# Altium schematic sheet EsquemaGeral.SchDoc
size A3
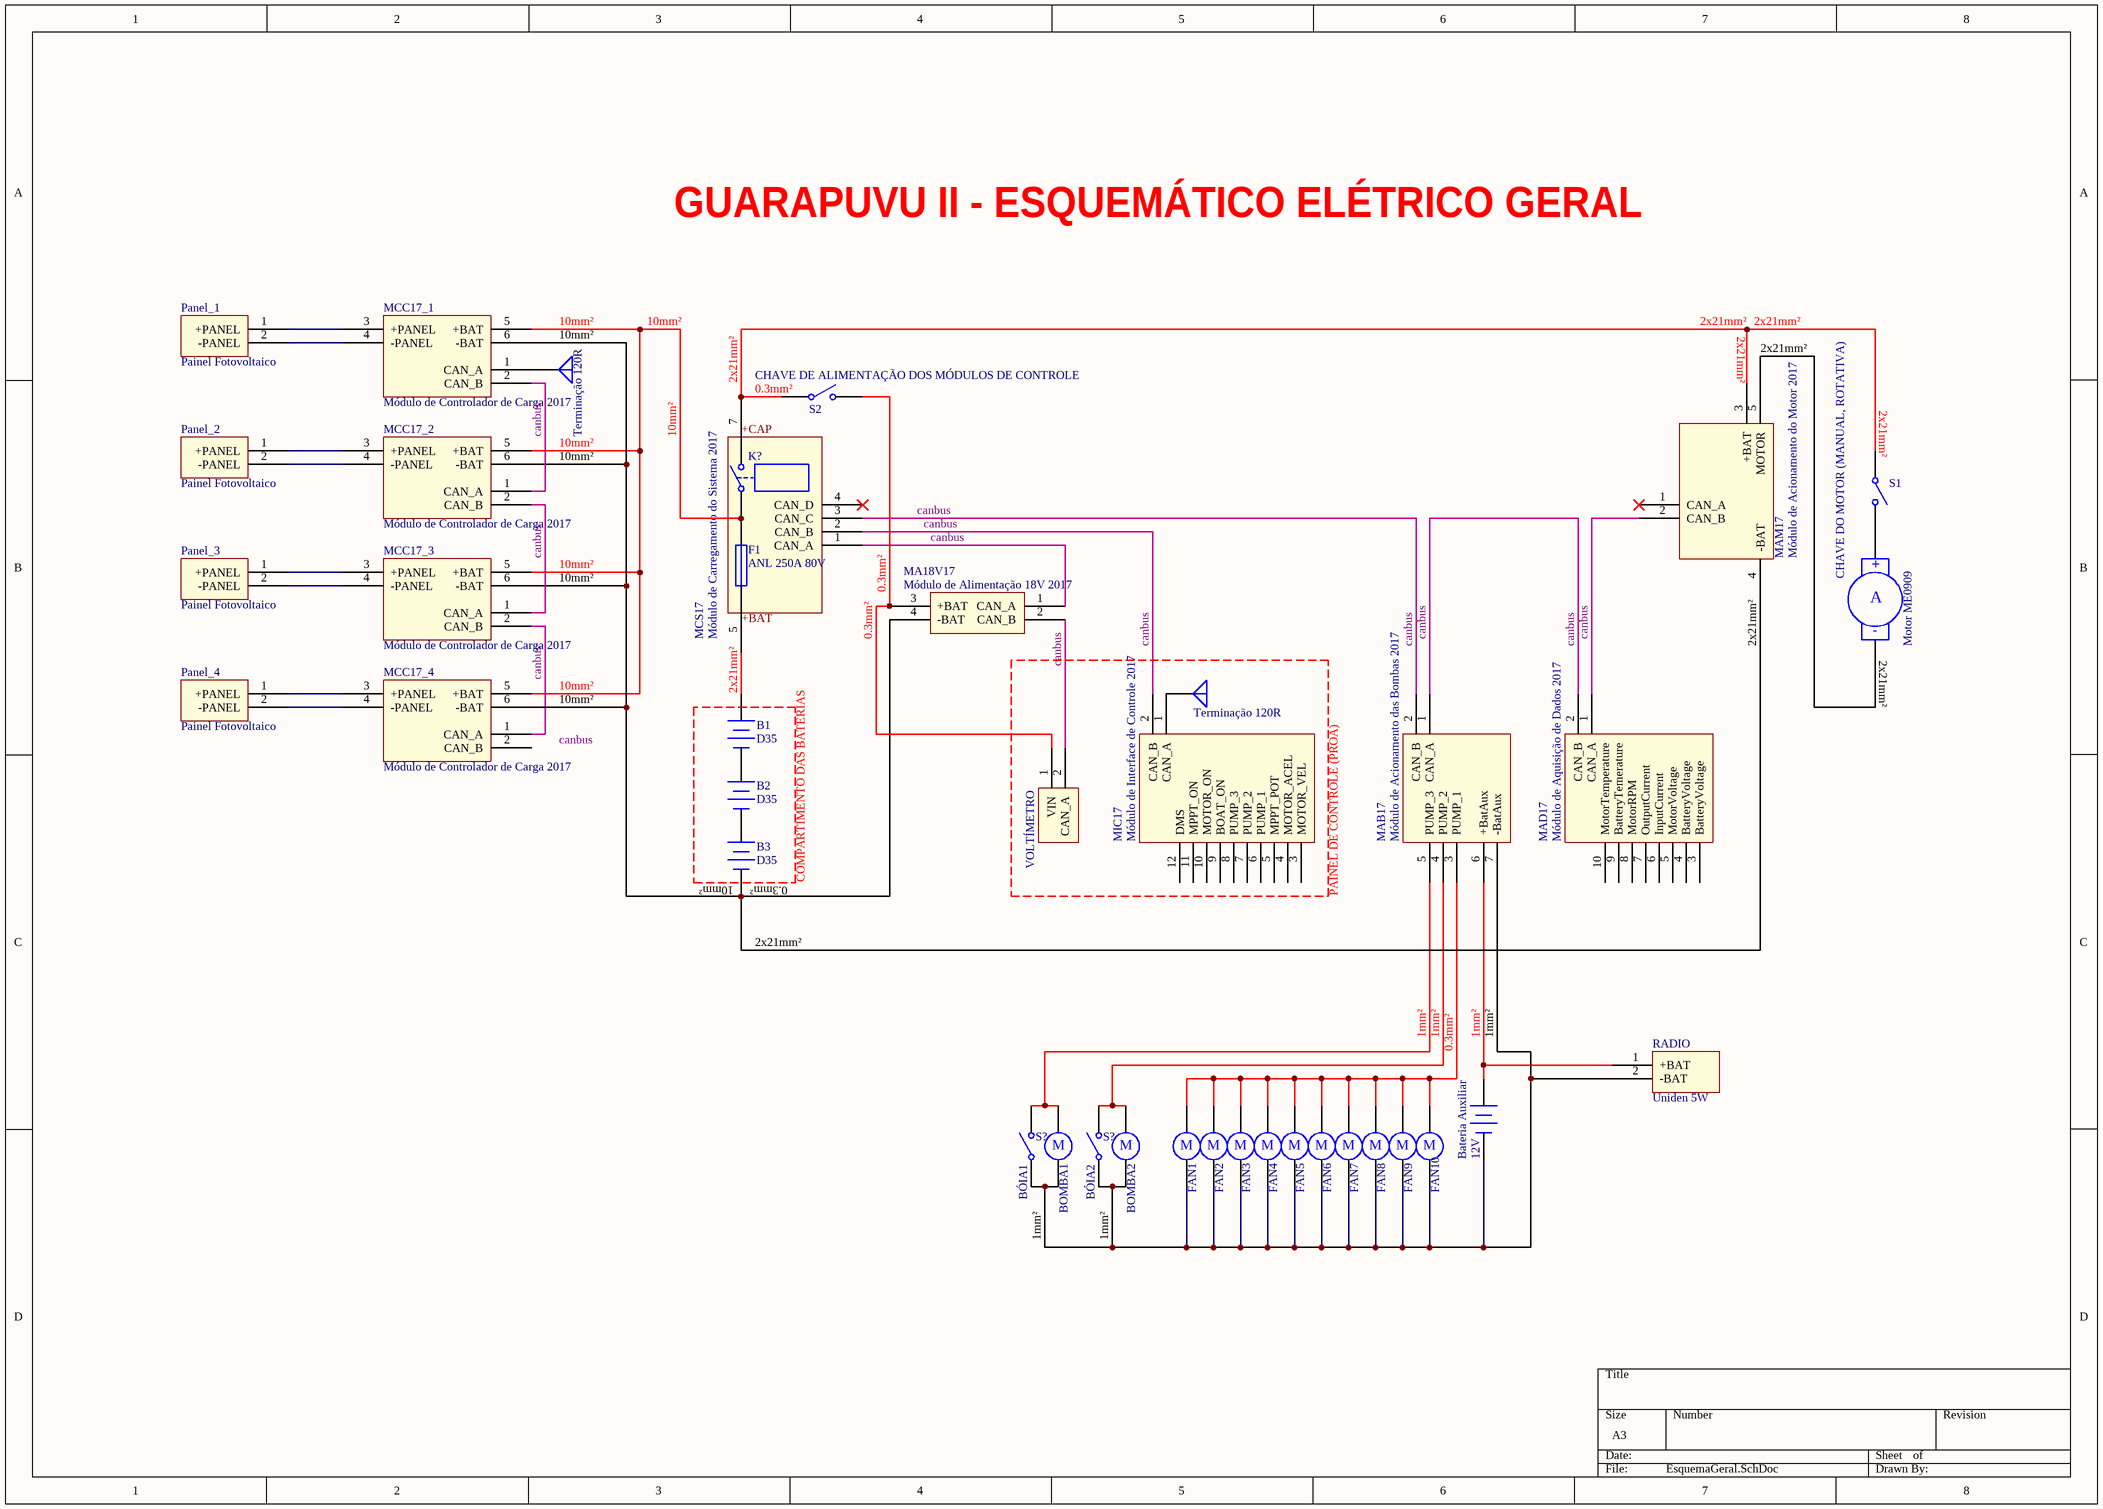
[diagram p0: EsquemaGeral.SchDoc]

## Parts
(Parts that share a designator on the sheet are numbered #1, #2 ... from top to bottom, then left to right.)
B1  D35  [BAT-2]
B2  D35  [BAT-2]
B3  D35  [BAT-2]
Bateria_Auxiliar  12V  [BAT-2]
BOMBA1  Motor  [RB5-10.5]  (value not drawn)
BOMBA2  Motor  [RB5-10.5]  (value not drawn)
F1  ANL 250A 80V  [PIN-W2/E2.8]
FAN1  Motor  [RB5-10.5]  (value not drawn)
FAN2  Motor  [RB5-10.5]  (value not drawn)
FAN3  Motor  [RB5-10.5]  (value not drawn)
FAN4  Motor  [RB5-10.5]  (value not drawn)
FAN5  Motor  [RB5-10.5]  (value not drawn)
FAN6  Motor  [RB5-10.5]  (value not drawn)
FAN7  Motor  [RB5-10.5]  (value not drawn)
FAN8  Motor  [RB5-10.5]  (value not drawn)
FAN9  Motor  [RB5-10.5]  (value not drawn)
FAN10  Motor  [RB5-10.5]  (value not drawn)
K?  K100A  [DIP-P4]  (value not drawn)
M1  Motor ME0909  [RAD-0.4]
MA18V17  Módulo de Alimentação 18V 2017
MAB17  Módulo de Acionamento das Bombas 2017
MAD17  Módulo de Aquisição de Dados 2017
MAM17  Módulo de Acionamento do Motor 2017
MCC17_1  Módulo de Controlador de Carga 2017
MCC17_2  Módulo de Controlador de Carga 2017
MCC17_3  Módulo de Controlador de Carga 2017
MCC17_4  Módulo de Controlador de Carga 2017
MCS17  Módulo de Carregamento do Sistema 2017
MIC17  Módulo de Interface de Controle 2017
Panel_1  Painel Fotovoltaico
Panel_2  Painel Fotovoltaico
Panel_3  Painel Fotovoltaico
Panel_4  Painel Fotovoltaico
RADIO  Uniden 5W
S1  CHAVE DO MOTOR (MANUAL, ROTATIVA)  [SPST-2]
S2  CHAVE DE ALIMENTAÇÃO DOS MÓDULOS DE CONTROLE  [SPST-2]
S?#1  BÓIA1  [SPST-2]
S?#2  BÓIA2  [SPST-2]
TR1  Terminação 120R  [PIN1]
TR2  Terminação 120R  [PIN1]
VOLTÍMETRO  VOLTÍMETRO  (value not drawn)

## Nets
+CAP: K?.2
NetB1_1: B1.1(+) MCS17.5(+BAT)
NetB3_2: B3.2(-) MA18V17.4(-BAT) MAM17.4(-BAT) MCC17_1.6(-BAT) MCC17_2.6(-BAT) MCC17_3.6(-BAT) MCC17_4.6(-BAT)
NetBateria_Auxiliar_1: Bateria_Auxiliar.1(+) MAB17.6(+BatAux) RADIO.1(+BAT)
NetBateria_Auxiliar_2: Bateria_Auxiliar.2(-) BOMBA1.2 BOMBA2.2 FAN1.2 FAN2.2 FAN3.2 FAN4.2 FAN5.2 FAN6.2 FAN7.2 FAN8.2 FAN9.2 FAN10.2 MAB17.7(-BatAux) RADIO.2(-BAT) S?#1.1(COMMON) S?#2.1(COMMON)
NetBOMBA1_1: BOMBA1.1 MAB17.5(PUMP_3) S?#1.2(NO)
NetBOMBA2_1: BOMBA2.1 MAB17.4(PUMP_2) S?#2.2(NO)
NetF1_2: F1.2 K?.1 MCC17_1.5(+BAT) MCC17_2.5(+BAT) MCC17_3.5(+BAT) MCC17_4.5(+BAT)
NetFAN1_1: FAN1.1 FAN2.1 FAN3.1 FAN4.1 FAN5.1 FAN6.1 FAN7.1 FAN8.1 FAN9.1 FAN10.1 MAB17.3(PUMP_1)
NetM1_1: M1.1(+) S1.2(NO)
NetM1_2: M1.2(-) MAM17.5(MOTOR)
NetMA18V17_1: MA18V17.1(CAN_A) MCS17.1(CAN_A)
NetMA18V17_2: MA18V17.2(CAN_B) VOLTÍMETRO.2(CAN_A)
NetMA18V17_3: MA18V17.3(+BAT) S2.2(NO) VOLTÍMETRO.1(VIN)
NetMAB17_1: MAB17.1(CAN_A) MAD17.2(CAN_B)
NetMAB17_2: MAB17.2(CAN_B) MCS17.3(CAN_C)
NetMAD17_1: MAD17.1(CAN_A) MAM17.2(CAN_B)
NetMAM17_3: MAM17.3(+BAT) MCS17.7(+CAP) S1.1(COMMON) S2.1(COMMON)
NetMCC17_1_1: MCC17_1.1(CAN_A) TR2.1(A)
NetMCC17_1_2: MCC17_1.2(CAN_B) MCC17_2.1(CAN_A)
NetMCC17_1_3: MCC17_1.3(+PANEL) Panel_1.1(+PANEL)
NetMCC17_1_4: MCC17_1.4(-PANEL) Panel_1.2(-PANEL)
NetMCC17_2_2: MCC17_2.2(CAN_B) MCC17_3.1(CAN_A)
NetMCC17_2_3: MCC17_2.3(+PANEL) Panel_2.1(+PANEL)
NetMCC17_2_4: MCC17_2.4(-PANEL) Panel_2.2(-PANEL)
NetMCC17_3_2: MCC17_3.2(CAN_B) MCC17_4.1(CAN_A)
NetMCC17_3_3: MCC17_3.3(+PANEL) Panel_3.1(+PANEL)
NetMCC17_3_4: MCC17_3.4(-PANEL) Panel_3.2(-PANEL)
NetMCC17_4_3: MCC17_4.3(+PANEL) Panel_4.1(+PANEL)
NetMCC17_4_4: MCC17_4.4(-PANEL) Panel_4.2(-PANEL)
NetMCS17_2: MCS17.2(CAN_B) MIC17.2(CAN_B)
NetMIC17_1: MIC17.1(CAN_A) TR1.1(A)

Not connected (* = marked no-connect by the designer): B1 2(-); B2 1(+) 2(-); B3 1(+); F1 1; MAD17 3(BatteryVoltage) 4(BatteryVoltage) 5(MotorVoltage) 6(InputCurrent) 7(OutputCurrent) 8(MotorRPM) 9(BatteryTemerature) 10(MotorTemperature); MAM17 1(CAN_A)*; MCC17_4 2(CAN_B); MCS17 4(CAN_D)*; MIC17 3(MOTOR_VEL) 4(MOTOR_ACEL) 5(MPPT_POT) 6(PUMP_1) 7(PUMP_2) 8(PUMP_3) 9(BOAT_ON) 10(MOTOR_ON) 11(MPPT_ON) 12(DMS)

## Notes on the sheet
- GUARAPUVU II - ESQUEMÁTICO ELÉTRICO GERAL
- (near TR2) 10mm²
- 10mm²
- 2x21mm²
- (near MAM17) 2x21mm²
- canbus
- (near S2) 0.3mm²
- (near S1) 2x21mm²
- 0.3mm²
- (near MA18V17) canbus
- (near M1) 2x21mm²
- (near B3) 10mm²
- (near B3) 0.3mm²
- COMPARTIMENTO DAS BATERIAS
- (near MIC17) PAINEL DE CONTROLE (PROA)
- 1mm²
- Labels drawn without touching a wire or pin: +BAT
- (in symbol Motor) M
- (in symbol Motor Servo) A

## Library data of the parts
B1-B3 Bateria_Auxiliar = Battery: Multicell Battery; Published: 24-Mar-1999; LatestRevisionDate: 17-Jul-2002; LatestRevisionNote: Re-released for DXP Platform.; PackageReference: BAT-2; Publisher: Altium Limited
BOMBA1 BOMBA2 FAN1-FAN10 = Motor: Motor, General Kind; Published: 24-Mar-1999; LatestRevisionDate: 17-Jul-2002; LatestRevisionNote: Re-released for DXP Platform.; PackageReference: RB5-10.5; Publisher: Altium Limited
F1 = Fuse 1: Fuse; Published: 8-Jun-2000; LatestRevisionDate: 17-Jul-2002; LatestRevisionNote: Re-released for DXP Platform.; PackageReference: PIN-W2/E2.8; Publisher: Altium Limited
K? = Relay-SPST: Single-Pole Single-Throw Relay; Published: 24-Mar-1999; LatestRevisionDate: 17-Jul-2002; LatestRevisionNote: Re-released for DXP Platform.; PackageReference: MODULE4; Publisher: Altium Limited
M1 = Motor Servo: Servo Motor; Published: 24-Mar-1999; LatestRevisionDate: 17-Jul-2002; LatestRevisionNote: Re-released for DXP Platform.; PackageReference: RAD-0.4; Publisher: Altium Limited
MA18V17 = MA18V17
MAB17 = MAB17
MAD17 = MAD17
MAM17 = MAM17
MCC17_1-MCC17_4 = MCC17
MCS17 = MCS17
MIC17 = MIC17
Panel_1-Panel_4 = PANEL
RADIO = RADIO
S1 S2 S?#1 S?#2 = SW-SPST: Single-Pole, Single-Throw Switch; Published: 24-Mar-1999; LatestRevisionDate: 17-Jul-2002; LatestRevisionNote: Re-released for DXP Platform.; PackageReference: SPST-2; Publisher: Altium Limited
TR1 TR2 = Antenna: Generic Antenna; Published: 24-Mar-1999; LatestRevisionDate: 17-Jul-2002; LatestRevisionNote: Re-released for DXP Platform.; PackageReference: PIN1; Publisher: Altium Limited